# Altium schematic sheet ESP-WROOM32.SchDoc (part 3 of 3)
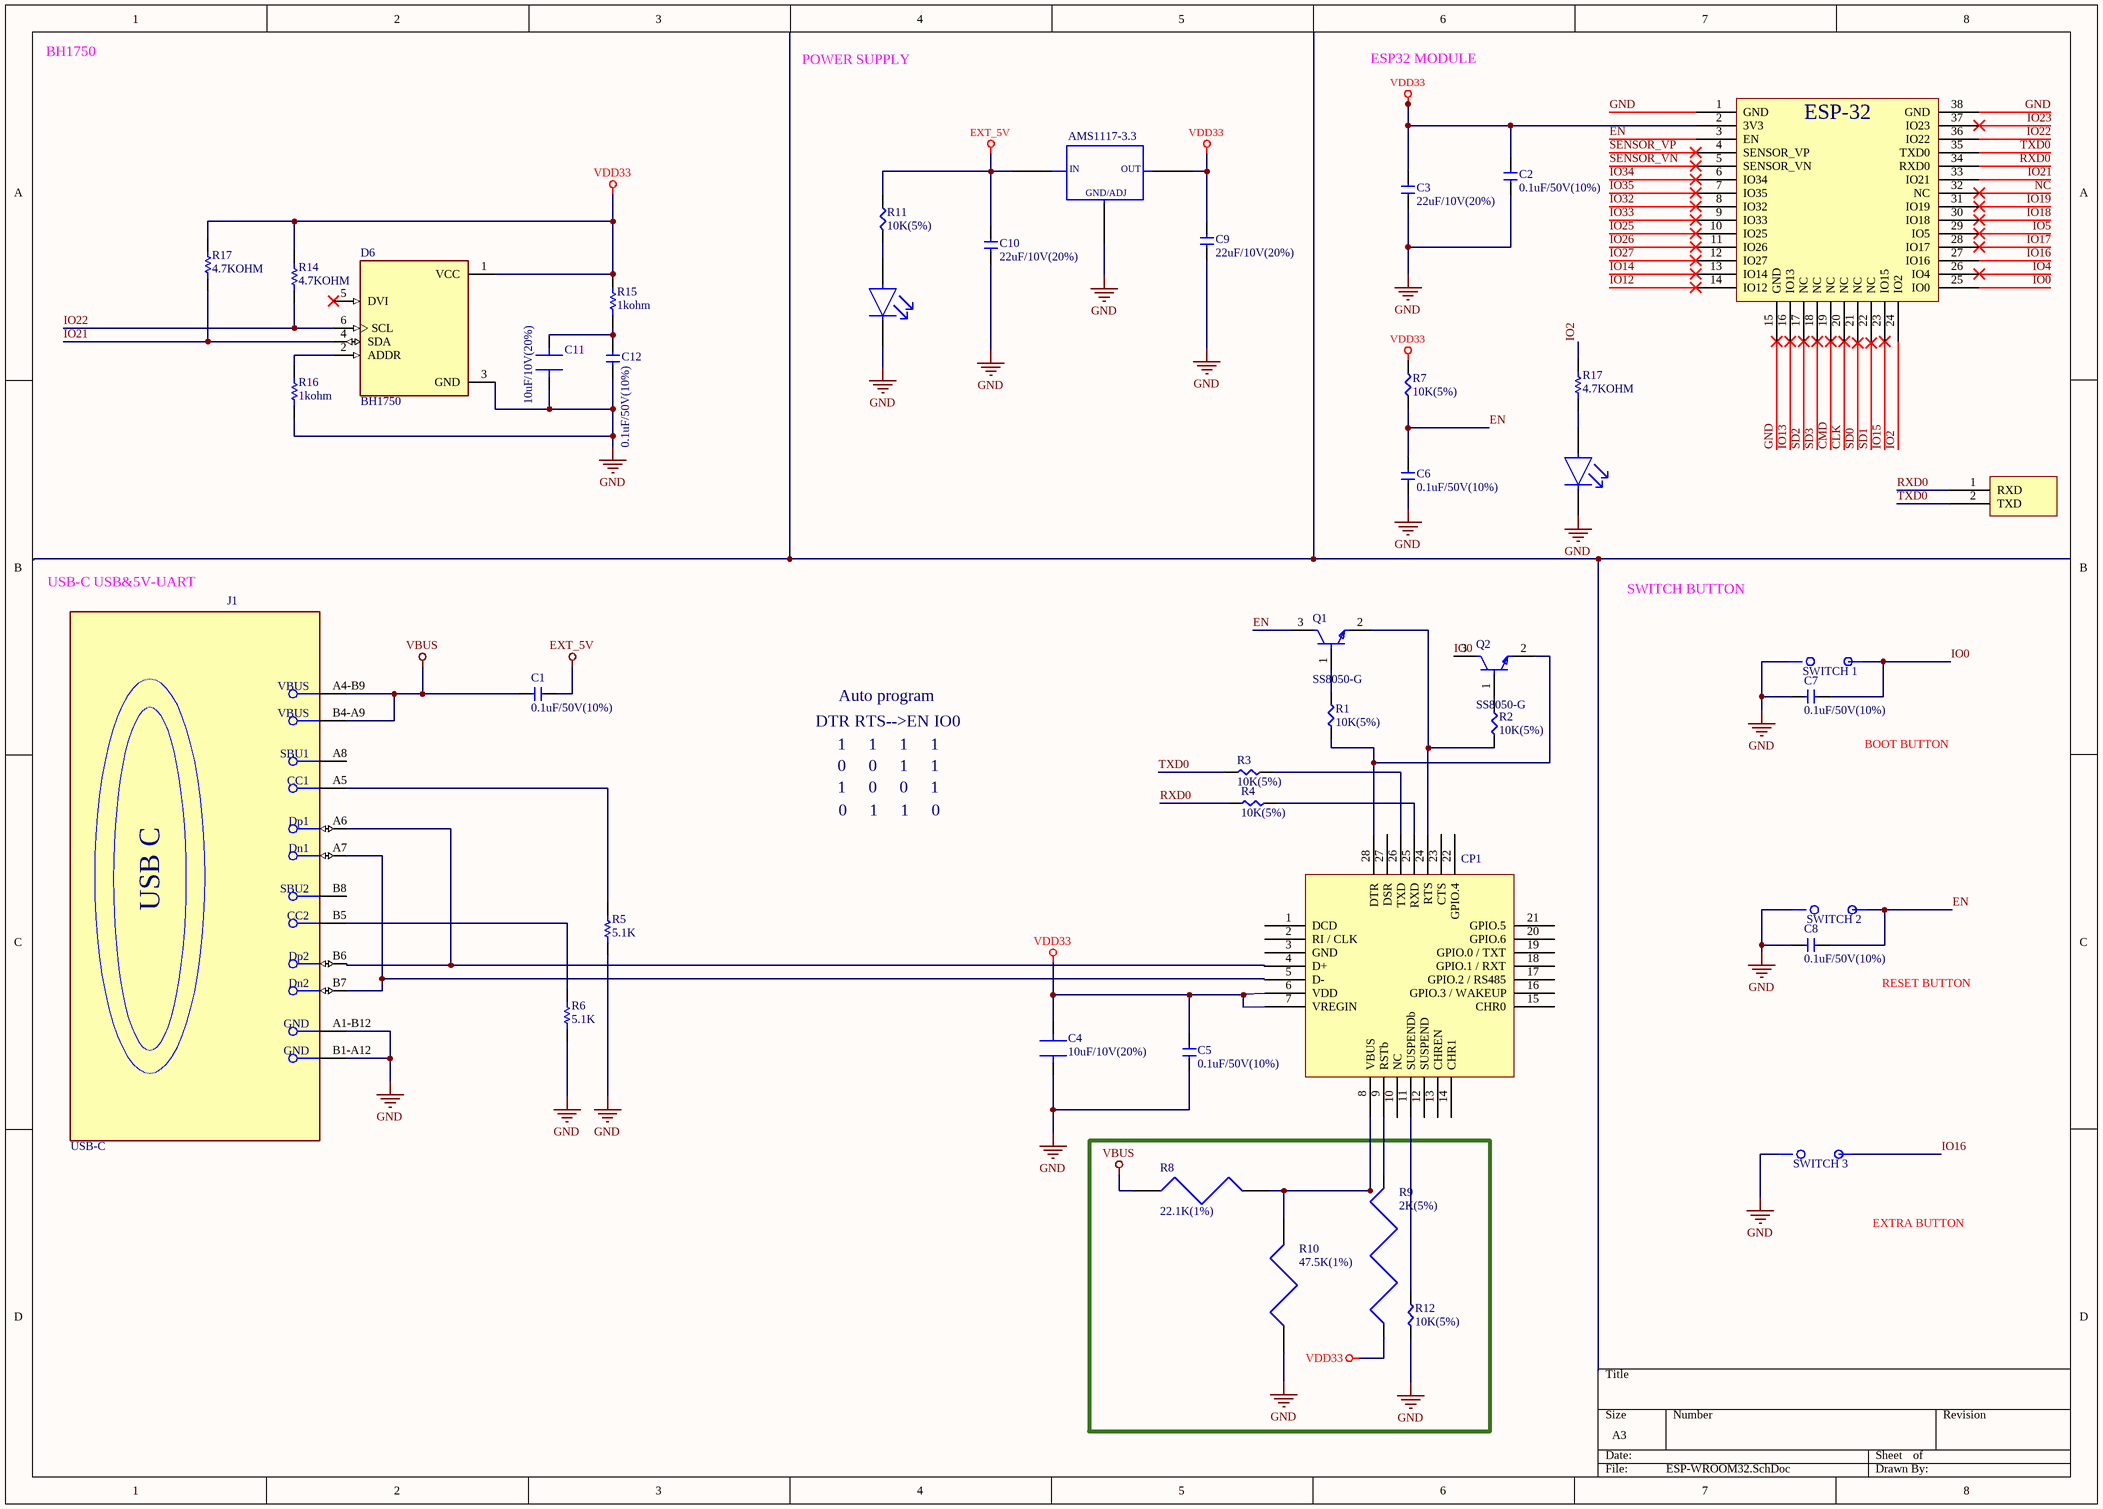
[diagram p2: ESP-WROOM32.SchDoc]

## Library data of the parts (continued)
R9 = RC1206JR-132KL: RES 2K OHM 5% 1/4W 1206; Manufacturer: Yageo Group; Manufacturer Part Number: RC0402JR-072KL; Power Dissipation: 62.5mW; Value: 2kΩ; Temperature Coefficient: 100ppm/°C; Voltage Rating: 50V; Supplier: DigiKey; Supplier Part Number: 311-2.0KJRCT-ND; RoHS: Compliant; Category: Chip SMD Resistors; Stock: 102655; Pricing: 1=0.1, 10=0.006, 25=0.0056, 50=0.0052, 100=0.0046, 250=0.00416, 500=0.00284 (USD); Case/Package: 0402; Case Code (Imperial): 0402; China RoHS: Non-Compliant; Composition: Thick Film; Contact Plating: Tin; Depth: 500µm; Height: 350µm; Lead Free: Lead Free; Length: 1mm; Lifecycle Status: Production; Max Operating Temperature: 155°C; Military Standard: Not; Min Operating Temperature: -55°C; Mounting Technology: Surface Mount; Pins: 2; Number of Terminals: 2; Packaging: Tape & Reel; Power Rating: 62.5mW; Radiation Hardening: No; REACH SVHC: Yes; Schedule B: 8533210045, 8533210045|8533210045|8533210045|8533210045|8533210045; Termination: SMD/SMT; Tolerance: 5%; Voltage Rating (DC): 50V; Width: 500µm; Working Voltage: 50V; ComponentLink1URL: https://datasheet.octopart.com:443/RC0402JR-072KL-Yageo-datasheet-175887523.pdf?src-supplier=Newark; ComponentLink1Description: https://datasheet.octopart.com:443/RC0402JR-072KL-Yageo-datasheet-175887523.pdf?src-supplier=Newark; ComponentLink2URL: https://datasheet.octopart.com:443/RC0402JR-072KL-Yageo-datasheet-10408619.pdf?src-supplier=Farnell; ComponentLink2Description: https://datasheet.octopart.com:443/RC0402JR-072KL-Yageo-datasheet-10408619.pdf?src-supplier=Farnell; ComponentLink3URL: https://datasheet.octopart.com:443/RC0402JR-072KL-Yageo-datasheet-62067350.pdf?src-supplier=Farnell; ComponentLink3Description: https://datasheet.octopart.com:443/RC0402JR-072KL-Yageo-datasheet-62067350.pdf?src-supplier=Farnell; ComponentLink4URL: https://datasheet.octopart.com:443/RC0402JR-072KL-Yageo-datasheet-164759695.pdf?src-supplier=Future+Electronics; ComponentLink4Description: https://datasheet.octopart.com:443/RC0402JR-072KL-Yageo-datasheet-164759695.pdf?src-supplier=Future+Electronics; ComponentLink5URL: https://datasheet.octopart.com:443/RC0402JR-072KL-Yageo-datasheet-137700087.pdf?src-supplier=Future+Electronics; ComponentLink5Description: https://datasheet.octopart.com:443/RC0402JR-072KL-Yageo-datasheet-137700087.pdf?src-supplier=Future+Electronics; ComponentLink6URL: https://datasheet.octopart.com:443/RC0402JR-072KL-Yageo-datasheet-12531192.pdf?src-supplier=Future+Electronics; ComponentLink6Description: https://datasheet.octopart.com:443/RC0402JR-072KL-Yageo-datasheet-12531192.pdf?src-supplier=Future+Electronics; ComponentLink7URL: https://datasheet.octopart.com:443/RC0402JR-072KL-Yageo-datasheet-505231.pdf?src-supplier=Future+Electronics; ComponentLink7Description: https://datasheet.octopart.com:443/RC0402JR-072KL-Yageo-datasheet-505231.pdf?src-supplier=Future+Electronics; ComponentLink8URL: https://datasheet.octopart.com/RC0402JR-072KL-Yageo-datasheet-73766026.pdf; ComponentLink8Description: https://datasheet.octopart.com/RC0402JR-072KL-Yageo-datasheet-73766026.pdf; ComponentLink9URL: https://datasheet.octopart.com:443/RC0402JR-072KL-Yageo-datasheet-8329306.pdf?src-supplier=element14; ComponentLink9Description: https://datasheet.octopart.com:443/RC0402JR-072KL-Yageo-datasheet-8329306.pdf?src-supplier=element14; ComponentLink10URL: https://datasheet.octopart.com:443/RC0402JR-072KL-Yageo-datasheet-8324527.pdf?src-supplier=TME; ComponentLink10Description: https://datasheet.octopart.com:443/RC0402JR-072KL-Yageo-datasheet-8324527.pdf?src-supplier=TME; ComponentLink11URL: http://sigma.octopart.com:80/rohs_statement/Yageo-company-2.pdf?src-supplier=Compliance+Statements; ComponentLink11Description: http://sigma.octopart.com:80/rohs_statement/Yageo-company-2.pdf?src-supplier=Compliance+Statements; ComponentLink12URL: http://sigma.octopart.com:80/conflict_mineral_statement/Yageo-company-3.pdf?src-supplier=Compliance+Statements; ComponentLink12Description: http://sigma.octopart.com:80/conflict_mineral_statement/Yageo-company-3.pdf?src-supplier=Compliance+Statements; LCSC PART NUMBER: C108081; Case Code (Metric): 3216; ComponentLink13URL: https://datasheet.octopart.com:443/RC1206JR-132KL-Yageo-datasheet-175887523.pdf?src-supplier=IHS; ComponentLink13Description: https://datasheet.octopart.com:443/RC1206JR-132KL-Yageo-datasheet-175887523.pdf?src-supplier=IHS; ComponentLink14URL: https://datasheet.octopart.com:443/RC1206JR-132KL-Yageo-datasheet-164759695.pdf?src-supplier=Future+Electronics; ComponentLink14Description: https://datasheet.octopart.com:443/RC1206JR-132KL-Yageo-datasheet-164759695.pdf?src-supplier=Future+Electronics; ComponentLink15URL: https://datasheet.octopart.com:443/RC1206JR-132KL-Yageo-datasheet-137700087.pdf?src-supplier=Future+Electronics; ComponentLink15Description: https://datasheet.octopart.com:443/RC1206JR-132KL-Yageo-datasheet-137700087.pdf?src-supplier=Future+Electronics; ComponentLink16URL: https://datasheet.octopart.com:443/RC1206JR-132KL-Yageo-datasheet-27233761.pdf?src-supplier=Future+Electronics; ComponentLink16Description: https://datasheet.octopart.com:443/RC1206JR-132KL-Yageo-datasheet-27233761.pdf?src-supplier=Future+Electronics; ComponentLink17URL: https://datasheet.octopart.com:443/RC1206JR-132KL-Yageo-datasheet-13032847.pdf?src-supplier=Future+Electronics; ComponentLink17Description: https://datasheet.octopart.com:443/RC1206JR-132KL-Yageo-datasheet-13032847.pdf?src-supplier=Future+Electronics; ComponentLink18URL: https://datasheet.octopart.com:443/RC1206JR-132KL-Yageo-datasheet-8359522.pdf?src-supplier=Future+Electronics; ComponentLink18Description: https://datasheet.octopart.com:443/RC1206JR-132KL-Yageo-datasheet-8359522.pdf?src-supplier=Future+Electronics; ComponentLink19URL: https://datasheet.octopart.com/RC1206JR-132KL-Yageo-datasheet-73766026.pdf; ComponentLink19Description: https://datasheet.octopart.com/RC1206JR-132KL-Yageo-datasheet-73766026.pdf; Parameter 1: *
R10 = RC1206FR-0747K5L: RES 47.5K OHM 1% 1/4W 1206; Manufacturer: Yageo Group; Manufacturer Part Number: RC0402FR-1347K5L; Power Dissipation: 62.5mW; Value: 47.5kΩ; Temperature Coefficient: 100ppm/°C; Working Voltage: 50V; Max Power Dissipation: 250mW; Voltage Rating: 200V; Supplier: DigiKey; Supplier Part Number: 13-RC0402FR-1347K5LCT-ND; RoHS: Compliant; Category: Chip SMD Resistors; Stock: 75939; Pricing: 1=0.1, 10=0.02, 25=0.014, 50=0.0112, 100=0.009, 250=0.00688, 500=0.00566, 1000=0.00474, 5000=0.00328 (USD); Case/Package: 0402; China RoHS: Non-Compliant; Composition: Thick Film; Contact Plating: Tin; Depth: 500µm; Height: 350µm; Length: 1mm; Lifecycle Status: Production; Max Operating Temperature: 155°C; Military Standard: Not; Min Operating Temperature: -55°C; Mounting Technology: Surface Mount; Number of Terminals: 2; REACH SVHC: Yes; Tolerance: 1%; Width: 500µm; ComponentLink1URL: https://datasheet.octopart.com:443/RC0402FR-1347K5L-Yageo-datasheet-175887523.pdf?src-supplier=IHS; ComponentLink1Description: https://datasheet.octopart.com:443/RC0402FR-1347K5L-Yageo-datasheet-175887523.pdf?src-supplier=IHS; ComponentLink2URL: https://datasheet.octopart.com:443/RC0402FR-1347K5L-Yageo-Group-datasheet-189192902.pdf?src-supplier=TME; ComponentLink2Description: https://datasheet.octopart.com:443/RC0402FR-1347K5L-Yageo-Group-datasheet-189192902.pdf?src-supplier=TME; ComponentLink3URL: https://datasheet.octopart.com:443/RC0402FR-1347K5L-Yageo-Group-datasheet-176638170.pdf?src-supplier=TME; ComponentLink3Description: https://datasheet.octopart.com:443/RC0402FR-1347K5L-Yageo-Group-datasheet-176638170.pdf?src-supplier=TME; ComponentLink4URL: https://datasheet.octopart.com/RC0402FR-1347K5L-Yageo-datasheet-73766026.pdf; ComponentLink4Description: https://datasheet.octopart.com/RC0402FR-1347K5L-Yageo-datasheet-73766026.pdf; ComponentLink5URL: https://datasheet.octopart.com:443/RC0402FR-1347K5L-Yageo-datasheet-10408619.pdf?src-supplier=_legacy+Avnet; ComponentLink5Description: https://datasheet.octopart.com:443/RC0402FR-1347K5L-Yageo-datasheet-10408619.pdf?src-supplier=_legacy+Avnet; ComponentLink6URL: http://sigma.octopart.com:80/conflict_mineral_statement/Yageo-company-3.pdf?src-supplier=Compliance+Statements; ComponentLink6Description: http://sigma.octopart.com:80/conflict_mineral_statement/Yageo-company-3.pdf?src-supplier=Compliance+Statements; ComponentLink7URL: http://sigma.octopart.com:80/rohs_statement/Yageo-company-2.pdf?src-supplier=Compliance+Statements; ComponentLink7Description: http://sigma.octopart.com:80/rohs_statement/Yageo-company-2.pdf?src-supplier=Compliance+Statements; LCSC PART NUMBER: C137271; Case Code (Imperial): 1206; Case Code (Metric): 3216; Features: Moisture Resistant; Lead Free: Lead Free; Number of Terminations: 2; Packaging: Tape & Reel; Power Rating: 250mW; Schedule B: 8533210045, 8533210045|8533210045|8533210045|8533210045|8533210045|8533210045|8533210045|8533210045|8533210045|8533210045|8533210045|8533210045|8533210045|8533210045|8533210045|8533210045, 8533210045|8533210045|8533210045|8533210045|8533210045|8533210045|8533210045|8533210045|8533210045|8533210045|8533210045|8533210045|8533210045|8533210045|8533210045|8533210045|8533210045, 8533210045|8533210045|8533210045|8533210045|8533210045|8533210045|8533210045|8533210045|8533210045|8533210045|8533210045|8533210045|8533210045|8533210045|8533210045|8533210045|8533210045|8533210045; Termination: SMD/SMT; Voltage Rating (DC): 200V; ComponentLink8URL: https://datasheet.octopart.com:443/RC1206FR-0747K5L-Yageo-datasheet-175887523.pdf?src-supplier=Newark; ComponentLink8Description: https://datasheet.octopart.com:443/RC1206FR-0747K5L-Yageo-datasheet-175887523.pdf?src-supplier=Newark; ComponentLink9URL: https://datasheet.octopart.com:443/RC1206FR-0747K5L-Yageo-datasheet-103092701.pdf?src-supplier=Upverter; ComponentLink9Description: https://datasheet.octopart.com:443/RC1206FR-0747K5L-Yageo-datasheet-103092701.pdf?src-supplier=Upverter; ComponentLink10URL: https://datasheet.octopart.com:443/RC1206FR-0747K5L-Yageo-Group-datasheet-189192902.pdf?src-supplier=TME; ComponentLink10Description: https://datasheet.octopart.com:443/RC1206FR-0747K5L-Yageo-Group-datasheet-189192902.pdf?src-supplier=TME; ComponentLink11URL: https://datasheet.octopart.com:443/RC1206FR-0747K5L-Yageo-Group-datasheet-176638170.pdf?src-supplier=TME; ComponentLink11Description: https://datasheet.octopart.com:443/RC1206FR-0747K5L-Yageo-Group-datasheet-176638170.pdf?src-supplier=TME; ComponentLink12URL: https://datasheet.octopart.com:443/RC1206FR-0747K5L-Yageo-datasheet-164759695.pdf?src-supplier=Future+Electronics; ComponentLink12Description: https://datasheet.octopart.com:443/RC1206FR-0747K5L-Yageo-datasheet-164759695.pdf?src-supplier=Future+Electronics; ComponentLink13URL: https://datasheet.octopart.com:443/RC1206FR-0747K5L-Yageo-datasheet-137700087.pdf?src-supplier=Future+Electronics; ComponentLink13Description: https://datasheet.octopart.com:443/RC1206FR-0747K5L-Yageo-datasheet-137700087.pdf?src-supplier=Future+Electronics; ComponentLink14URL: https://datasheet.octopart.com:443/RC1206FR-0747K5L-Yageo-datasheet-27233761.pdf?src-supplier=Future+Electronics; ComponentLink14Description: https://datasheet.octopart.com:443/RC1206FR-0747K5L-Yageo-datasheet-27233761.pdf?src-supplier=Future+Electronics; ComponentLink15URL: https://datasheet.octopart.com:443/RC1206FR-0747K5L-Yageo-datasheet-13032847.pdf?src-supplier=Future+Electronics; ComponentLink15Description: https://datasheet.octopart.com:443/RC1206FR-0747K5L-Yageo-datasheet-13032847.pdf?src-supplier=Future+Electronics; ComponentLink16URL: https://datasheet.octopart.com:443/RC1206FR-0747K5L-Yageo-datasheet-8359522.pdf?src-supplier=Future+Electronics; ComponentLink16Description: https://datasheet.octopart.com:443/RC1206FR-0747K5L-Yageo-datasheet-8359522.pdf?src-supplier=Future+Electronics; ComponentLink17URL: https://datasheet.octopart.com/RC1206FR-0747K5L-Yageo-datasheet-73766026.pdf; ComponentLink17Description: https://datasheet.octopart.com/RC1206FR-0747K5L-Yageo-datasheet-73766026.pdf; ComponentLink18URL: https://datasheet.octopart.com:443/RC1206FR-0747K5L-Yageo-datasheet-118639.pdf?src-supplier=DigiKey; ComponentLink18Description: https://datasheet.octopart.com:443/RC1206FR-0747K5L-Yageo-datasheet-118639.pdf?src-supplier=DigiKey
R14 R17#1 R17#2 = RC1206JR-074K7L: RES 4.7K OHM 5% 1/4W 1206; Manufacturer: Yageo Group; Manufacturer Part Number: RC0402JR-0747KL; Max Power Dissipation: 63mW; Power Dissipation: 62.5mW; Value: 47kΩ; Temperature Coefficient: 100ppm/°C; Voltage Rating: 50V; Supplier: DigiKey; Supplier Part Number: 311-47KJRCT-ND; RoHS: Compliant; Category: Chip SMD Resistors; Stock: 272791; Pricing: 1=0.1, 10=0.006, 25=0.0044, 50=0.003, 100=0.0028 (USD); Case/Package: 0402; Case Code (Imperial): 0402; China RoHS: Non-Compliant; Composition: Thick Film; Depth: 500µm; Features: Moisture Resistant; Height: 350µm; Lead Free: Lead Free; Length: 1mm; Lifecycle Status: Production; Max Operating Temperature: 155°C; Military Standard: Not; Min Operating Temperature: -55°C; Mounting Technology: Surface Mount; Pins: 2; Number of Terminals: 2; Number of Terminations: 2; Packaging: Tape & Reel; Power Rating: 63mW; REACH SVHC: Yes; Schedule B: 8533210045, 8533210045|8533210045, 8533210045|8533210045|8533210045, 8533210045|8533210045|8533210045|8533210045; Termination: SMD/SMT; Tolerance: 5%; Voltage Rating (AC): 50V; Voltage Rating (DC): 50V; Width: 500µm; Working Voltage: 50V; ComponentLink1URL: https://datasheet.octopart.com:443/RC0402JR-0747KL-Yageo-datasheet-175887523.pdf?src-supplier=IHS; ComponentLink1Description: https://datasheet.octopart.com:443/RC0402JR-0747KL-Yageo-datasheet-175887523.pdf?src-supplier=IHS; ComponentLink2URL: https://datasheet.octopart.com:443/RC0402JR-0747KL-Yageo-datasheet-10408619.pdf?src-supplier=Newark; ComponentLink2Description: https://datasheet.octopart.com:443/RC0402JR-0747KL-Yageo-datasheet-10408619.pdf?src-supplier=Newark; ComponentLink3URL: https://datasheet.octopart.com:443/RC0402JR-0747KL-Yageo-datasheet-8324527.pdf?src-supplier=Newark; ComponentLink3Description: https://datasheet.octopart.com:443/RC0402JR-0747KL-Yageo-datasheet-8324527.pdf?src-supplier=Newark; ComponentLink4URL: https://datasheet.octopart.com:443/RC0402JR-0747KL-Yageo-datasheet-98239111.pdf?src-supplier=Upverter; ComponentLink4Description: https://datasheet.octopart.com:443/RC0402JR-0747KL-Yageo-datasheet-98239111.pdf?src-supplier=Upverter; ComponentLink5URL: https://datasheet.octopart.com:443/RC0402JR-0747KL-Yageo-datasheet-62067350.pdf?src-supplier=element14+APAC; ComponentLink5Description: https://datasheet.octopart.com:443/RC0402JR-0747KL-Yageo-datasheet-62067350.pdf?src-supplier=element14+APAC; ComponentLink6URL: https://datasheet.octopart.com:443/RC0402JR-0747KL-Yageo-datasheet-176638170.pdf?src-supplier=JRH+Electronics; ComponentLink6Description: https://datasheet.octopart.com:443/RC0402JR-0747KL-Yageo-datasheet-176638170.pdf?src-supplier=JRH+Electronics; ComponentLink7URL: https://datasheet.octopart.com:443/RC0402JR-0747KL-Yageo-datasheet-164759695.pdf?src-supplier=Future+Electronics; ComponentLink7Description: https://datasheet.octopart.com:443/RC0402JR-0747KL-Yageo-datasheet-164759695.pdf?src-supplier=Future+Electronics; ComponentLink8URL: https://datasheet.octopart.com:443/RC0402JR-0747KL-Yageo-datasheet-137700087.pdf?src-supplier=Future+Electronics; ComponentLink8Description: https://datasheet.octopart.com:443/RC0402JR-0747KL-Yageo-datasheet-137700087.pdf?src-supplier=Future+Electronics; ComponentLink9URL: https://datasheet.octopart.com:443/RC0402JR-0747KL-Yageo-datasheet-12531192.pdf?src-supplier=Future+Electronics; ComponentLink9Description: https://datasheet.octopart.com:443/RC0402JR-0747KL-Yageo-datasheet-12531192.pdf?src-supplier=Future+Electronics; ComponentLink10URL: https://datasheet.octopart.com:443/RC0402JR-0747KL-Yageo-datasheet-8324255.pdf?src-supplier=Future+Electronics; ComponentLink10Description: https://datasheet.octopart.com:443/RC0402JR-0747KL-Yageo-datasheet-8324255.pdf?src-supplier=Future+Electronics; ComponentLink11URL: https://datasheet.octopart.com:443/RC0402JR-0747KL-Yageo-datasheet-148775077.pdf?src-supplier=TME; ComponentLink11Description: https://datasheet.octopart.com:443/RC0402JR-0747KL-Yageo-datasheet-148775077.pdf?src-supplier=TME; ComponentLink12URL: https://datasheet.octopart.com/RC0402JR-0747KL-Yageo-datasheet-73766026.pdf; ComponentLink12Description: https://datasheet.octopart.com/RC0402JR-0747KL-Yageo-datasheet-73766026.pdf; ComponentLink13URL: https://datasheet.octopart.com:443/RC0402JR-0747KL-Yageo-datasheet-8329306.pdf?src-supplier=element14; ComponentLink13Description: https://datasheet.octopart.com:443/RC0402JR-0747KL-Yageo-datasheet-8329306.pdf?src-supplier=element14; ComponentLink14URL: http://sigma.octopart.com:80/rohs_statement/Yageo-company-2.pdf?src-supplier=Compliance+Statements; ComponentLink14Description: http://sigma.octopart.com:80/rohs_statement/Yageo-company-2.pdf?src-supplier=Compliance+Statements; ComponentLink15URL: http://sigma.octopart.com:80/conflict_mineral_statement/Yageo-company-3.pdf?src-supplier=Compliance+Statements; ComponentLink15Description: http://sigma.octopart.com:80/conflict_mineral_statement/Yageo-company-3.pdf?src-supplier=Compliance+Statements; LCSC PART NUMBER: C136458; Case Code (Metric): 3216; ComponentLink16URL: https://datasheet.octopart.com:443/RC1206JR-074K7L-Yageo-datasheet-175887523.pdf?src-supplier=Newark; ComponentLink16Description: https://datasheet.octopart.com:443/RC1206JR-074K7L-Yageo-datasheet-175887523.pdf?src-supplier=Newark; ComponentLink17URL: https://datasheet.octopart.com:443/RC1206JR-074K7L-Yageo-datasheet-12512621.pdf?src-supplier=Newark; ComponentLink17Description: https://datasheet.octopart.com:443/RC1206JR-074K7L-Yageo-datasheet-12512621.pdf?src-supplier=Newark; ComponentLink18URL: https://datasheet.octopart.com:443/RC1206JR-074K7L-Yageo-datasheet-141435363.pdf?src-supplier=Upverter; ComponentLink18Description: https://datasheet.octopart.com:443/RC1206JR-074K7L-Yageo-datasheet-141435363.pdf?src-supplier=Upverter; ComponentLink19URL: https://datasheet.octopart.com:443/RC1206JR-074K7L-Yageo-datasheet-8359522.pdf?src-supplier=element14+APAC; ComponentLink19Description: https://datasheet.octopart.com:443/RC1206JR-074K7L-Yageo-datasheet-8359522.pdf?src-supplier=element14+APAC; ComponentLink20URL: https://datasheet.octopart.com:443/RC1206JR-074K7L-Yageo-datasheet-62067350.pdf?src-supplier=Farnell; ComponentLink20Description: https://datasheet.octopart.com:443/RC1206JR-074K7L-Yageo-datasheet-62067350.pdf?src-supplier=Farnell; ComponentLink21URL: https://datasheet.octopart.com:443/RC1206JR-074K7L-Yageo-datasheet-164759695.pdf?src-supplier=Future+Electronics; ComponentLink21Description: https://datasheet.octopart.com:443/RC1206JR-074K7L-Yageo-datasheet-164759695.pdf?src-supplier=Future+Electronics; ComponentLink22URL: https://datasheet.octopart.com:443/RC1206JR-074K7L-Yageo-datasheet-127823281.pdf?src-supplier=Future+Electronics; ComponentLink22Description: https://datasheet.octopart.com:443/RC1206JR-074K7L-Yageo-datasheet-127823281.pdf?src-supplier=Future+Electronics; ComponentLink23URL: https://datasheet.octopart.com:443/RC1206JR-074K7L-Yageo-datasheet-137700087.pdf?src-supplier=Future+Electronics; ComponentLink23Description: https://datasheet.octopart.com:443/RC1206JR-074K7L-Yageo-datasheet-137700087.pdf?src-supplier=Future+Electronics; ComponentLink24URL: https://datasheet.octopart.com:443/RC1206JR-074K7L-Yageo-datasheet-103092701.pdf?src-supplier=Future+Electronics; ComponentLink24Description: https://datasheet.octopart.com:443/RC1206JR-074K7L-Yageo-datasheet-103092701.pdf?src-supplier=Future+Electronics; ComponentLink25URL: https://datasheet.octopart.com:443/RC1206JR-074K7L-Yageo-datasheet-27233761.pdf?src-supplier=Future+Electronics; ComponentLink25Description: https://datasheet.octopart.com:443/RC1206JR-074K7L-Yageo-datasheet-27233761.pdf?src-supplier=Future+Electronics; ComponentLink26URL: https://datasheet.octopart.com:443/RC1206JR-074K7L-Yageo-datasheet-13032847.pdf?src-supplier=Future+Electronics; ComponentLink26Description: https://datasheet.octopart.com:443/RC1206JR-074K7L-Yageo-datasheet-13032847.pdf?src-supplier=Future+Electronics; ComponentLink27URL: https://datasheet.octopart.com:443/RC1206JR-074K7L-Yageo-datasheet-8324387.pdf?src-supplier=Future+Electronics; ComponentLink27Description: https://datasheet.octopart.com:443/RC1206JR-074K7L-Yageo-datasheet-8324387.pdf?src-supplier=Future+Electronics; ComponentLink28URL: https://datasheet.octopart.com/RC1206JR-074K7L-Yageo-datasheet-73766026.pdf; ComponentLink28Description: https://datasheet.octopart.com/RC1206JR-074K7L-Yageo-datasheet-73766026.pdf; ComponentLink29URL: https://datasheet.octopart.com:443/RC1206JR-074K7L-Yageo-datasheet-118639.pdf?src-supplier=DigiKey; ComponentLink29Description: https://datasheet.octopart.com:443/RC1206JR-074K7L-Yageo-datasheet-118639.pdf?src-supplier=DigiKey; ComponentLink30URL: https://datasheet.octopart.com:443/RC1206JR-074K7L-Yageo-datasheet-499455.pdf?src-supplier=element14; ComponentLink30Description: https://datasheet.octopart.com:443/RC1206JR-074K7L-Yageo-datasheet-499455.pdf?src-supplier=element14; ComponentLink31URL: https://datasheet.octopart.com:443/RC1206JR-074K7L-Yageo-datasheet-6387275.pdf?src-supplier=element14; ComponentLink31Description: https://datasheet.octopart.com:443/RC1206JR-074K7L-Yageo-datasheet-6387275.pdf?src-supplier=element14
R15 R16 = RC1206JR-071KL: RES 1K OHM 5% 1/4W 1206; Manufacturer: Yageo Group; Manufacturer Part Number: RC0402JR-071KL; LSCS PART NUMBER: C112223; Max Power Dissipation: 63mW; Power Dissipation: 62.5mW; Value: 1kΩ; Temperature Coefficient: 100ppm/°C; Voltage Rating: 50V; Supplier: DigiKey; Supplier Part Number: 311-1.0KJRCT-ND; RoHS: Compliant; Category: Chip SMD Resistors; Stock: 6491283; Pricing: 1=0.1, 10=0.006, 25=0.0052, 50=0.004, 100=0.0036, 250=0.00284 (USD); Case/Package: 0402; Case Code (Imperial): 0402; China RoHS: Non-Compliant; Composition: Thick Film; Depth: 500µm; Features: Moisture Resistant; Height: 350µm; Lead Free: Lead Free; Length: 1mm; Lifecycle Status: Production; Max Operating Temperature: 155°C; Military Standard: Not; Min Operating Temperature: -55°C; Mounting Technology: Surface Mount; Pins: 2; Number of Terminals: 2; Number of Terminations: 2; Packaging: Tape & Reel; Power Rating: 62.5mW; REACH SVHC: Yes; Schedule B: 8533210045, 8533210045|8533210045, 8533210045|8533210045|8533210045, 8533210045|8533210045|8533210045|8533210045; Termination: SMD/SMT; Tolerance: 5%; Voltage Rating (AC): 50V; Voltage Rating (DC): 50V; Width: 500µm; Working Voltage: 50V; ComponentLink1URL: https://datasheet.octopart.com:443/RC0402JR-071KL-Yageo-datasheet-175887523.pdf?src-supplier=Farnell; ComponentLink1Description: https://datasheet.octopart.com:443/RC0402JR-071KL-Yageo-datasheet-175887523.pdf?src-supplier=Farnell; ComponentLink2URL: https://datasheet.octopart.com:443/RC0402JR-071KL-Yageo-datasheet-8324527.pdf?src-supplier=Farnell; ComponentLink2Description: https://datasheet.octopart.com:443/RC0402JR-071KL-Yageo-datasheet-8324527.pdf?src-supplier=Farnell; ComponentLink3URL: https://datasheet.octopart.com:443/RC0402JR-071KL-Yageo-datasheet-10408619.pdf?src-supplier=Newark; ComponentLink3Description: https://datasheet.octopart.com:443/RC0402JR-071KL-Yageo-datasheet-10408619.pdf?src-supplier=Newark; ComponentLink4URL: https://datasheet.octopart.com:443/RC0402JR-071KL-Yageo-datasheet-505231.pdf?src-supplier=Newark; ComponentLink4Description: https://datasheet.octopart.com:443/RC0402JR-071KL-Yageo-datasheet-505231.pdf?src-supplier=Newark; ComponentLink5URL: https://datasheet.octopart.com:443/RC0402JR-071KL-Yageo-datasheet-79472498.pdf?src-supplier=Upverter; ComponentLink5Description: https://datasheet.octopart.com:443/RC0402JR-071KL-Yageo-datasheet-79472498.pdf?src-supplier=Upverter; ComponentLink6URL: https://datasheet.octopart.com:443/RC0402JR-071KL-Yageo-datasheet-44585784.pdf?src-supplier=Upverter; ComponentLink6Description: https://datasheet.octopart.com:443/RC0402JR-071KL-Yageo-datasheet-44585784.pdf?src-supplier=Upverter; ComponentLink7URL: https://datasheet.octopart.com:443/RC0402JR-071KL-Yageo-datasheet-62067350.pdf?src-supplier=element14+APAC; ComponentLink7Description: https://datasheet.octopart.com:443/RC0402JR-071KL-Yageo-datasheet-62067350.pdf?src-supplier=element14+APAC; ComponentLink8URL: https://datasheet.octopart.com:443/RC0402JR-071KL-Yageo-datasheet-148775077.pdf?src-supplier=JRH+Electronics; ComponentLink8Description: https://datasheet.octopart.com:443/RC0402JR-071KL-Yageo-datasheet-148775077.pdf?src-supplier=JRH+Electronics; ComponentLink9URL: https://datasheet.octopart.com:443/RC0402JR-071KL-Yageo-datasheet-12531192.pdf?src-supplier=Seeed+Studio; ComponentLink9Description: https://datasheet.octopart.com:443/RC0402JR-071KL-Yageo-datasheet-12531192.pdf?src-supplier=Seeed+Studio; ComponentLink10URL: https://datasheet.octopart.com:443/RC0402JR-071KL-Yageo-datasheet-164759695.pdf?src-supplier=Future+Electronics; ComponentLink10Description: https://datasheet.octopart.com:443/RC0402JR-071KL-Yageo-datasheet-164759695.pdf?src-supplier=Future+Electronics; ComponentLink11URL: https://datasheet.octopart.com:443/RC0402JR-071KL-Yageo-datasheet-137700087.pdf?src-supplier=Future+Electronics; ComponentLink11Description: https://datasheet.octopart.com:443/RC0402JR-071KL-Yageo-datasheet-137700087.pdf?src-supplier=Future+Electronics; ComponentLink12URL: https://datasheet.octopart.com/RC0402JR-071KL-Yageo-datasheet-73766026.pdf; ComponentLink12Description: https://datasheet.octopart.com/RC0402JR-071KL-Yageo-datasheet-73766026.pdf; ComponentLink13URL: https://datasheet.octopart.com:443/RC0402JR-071KL-Yageo-datasheet-8329306.pdf?src-supplier=element14; ComponentLink13Description: https://datasheet.octopart.com:443/RC0402JR-071KL-Yageo-datasheet-8329306.pdf?src-supplier=element14; ComponentLink14URL: http://sigma.octopart.com:80/rohs_statement/Yageo-company-2.pdf?src-supplier=Compliance+Statements; ComponentLink14Description: http://sigma.octopart.com:80/rohs_statement/Yageo-company-2.pdf?src-supplier=Compliance+Statements; ComponentLink15URL: http://sigma.octopart.com:80/conflict_mineral_statement/Yageo-company-3.pdf?src-supplier=Compliance+Statements; ComponentLink15Description: http://sigma.octopart.com:80/conflict_mineral_statement/Yageo-company-3.pdf?src-supplier=Compliance+Statements; LCSC PART NUMBER: C105637; Case Code (Metric): 3216; ComponentLink16URL: https://datasheet.octopart.com:443/RC1206JR-071KL-Yageo-datasheet-175887523.pdf?src-supplier=Newark; ComponentLink16Description: https://datasheet.octopart.com:443/RC1206JR-071KL-Yageo-datasheet-175887523.pdf?src-supplier=Newark; ComponentLink17URL: https://datasheet.octopart.com:443/RC1206JR-071KL-Yageo-datasheet-13032847.pdf?src-supplier=element14+APAC; ComponentLink17Description: https://datasheet.octopart.com:443/RC1206JR-071KL-Yageo-datasheet-13032847.pdf?src-supplier=element14+APAC; ComponentLink18URL: https://datasheet.octopart.com:443/RC1206JR-071KL-Yageo-datasheet-62067350.pdf?src-supplier=element14+APAC; ComponentLink18Description: https://datasheet.octopart.com:443/RC1206JR-071KL-Yageo-datasheet-62067350.pdf?src-supplier=element14+APAC; ComponentLink19URL: https://datasheet.octopart.com:443/RC1206JR-071KL-Yageo-datasheet-141265859.pdf?src-supplier=Upverter; ComponentLink19Description: https://datasheet.octopart.com:443/RC1206JR-071KL-Yageo-datasheet-141265859.pdf?src-supplier=Upverter; ComponentLink20URL: https://sigma.octopart.com:443/138820526/technical_drawing/Yageo-RC1206JR-071KL.pdf?src-supplier=Upverter; ComponentLink20Description: https://sigma.octopart.com:443/138820526/technical_drawing/Yageo-RC1206JR-071KL.pdf?src-supplier=Upverter; ComponentLink21URL: https://datasheet.octopart.com:443/RC1206JR-071KL-Yageo-datasheet-8359522.pdf?src-supplier=TME; ComponentLink21Description: https://datasheet.octopart.com:443/RC1206JR-071KL-Yageo-datasheet-8359522.pdf?src-supplier=TME; ComponentLink22URL: https://datasheet.octopart.com:443/RC1206JR-071KL-Yageo-datasheet-164759695.pdf?src-supplier=Future+Electronics; ComponentLink22Description: https://datasheet.octopart.com:443/RC1206JR-071KL-Yageo-datasheet-164759695.pdf?src-supplier=Future+Electronics; ComponentLink23URL: https://datasheet.octopart.com:443/RC1206JR-071KL-Yageo-datasheet-137700087.pdf?src-supplier=Future+Electronics; ComponentLink23Description: https://datasheet.octopart.com:443/RC1206JR-071KL-Yageo-datasheet-137700087.pdf?src-supplier=Future+Electronics; ComponentLink24URL: https://datasheet.octopart.com:443/RC1206JR-071KL-Yageo-datasheet-27233761.pdf?src-supplier=Future+Electronics; ComponentLink24Description: https://datasheet.octopart.com:443/RC1206JR-071KL-Yageo-datasheet-27233761.pdf?src-supplier=Future+Electronics; ComponentLink25URL: https://datasheet.octopart.com:443/RC1206JR-071KL-Yageo-datasheet-8324387.pdf?src-supplier=Future+Electronics; ComponentLink25Description: https://datasheet.octopart.com:443/RC1206JR-071KL-Yageo-datasheet-8324387.pdf?src-supplier=Future+Electronics; ComponentLink26URL: https://datasheet.octopart.com/RC1206JR-071KL-Yageo-datasheet-73766026.pdf; ComponentLink26Description: https://datasheet.octopart.com/RC1206JR-071KL-Yageo-datasheet-73766026.pdf; ComponentLink27URL: https://datasheet.octopart.com:443/RC1206JR-071KL-Yageo-datasheet-118639.pdf?src-supplier=DigiKey; ComponentLink27Description: https://datasheet.octopart.com:443/RC1206JR-071KL-Yageo-datasheet-118639.pdf?src-supplier=DigiKey; ComponentLink28URL: https://datasheet.octopart.com:443/RC1206JR-071KL-Yageo-datasheet-499455.pdf?src-supplier=element14; ComponentLink28Description: https://datasheet.octopart.com:443/RC1206JR-071KL-Yageo-datasheet-499455.pdf?src-supplier=element14; ComponentLink29URL: https://datasheet.octopart.com:443/RC1206JR-071KL-Yageo-datasheet-6387275.pdf?src-supplier=element14; ComponentLink29Description: https://datasheet.octopart.com:443/RC1206JR-071KL-Yageo-datasheet-6387275.pdf?src-supplier=element14
SWITCH_1-SWITCH_3 = PTS645SL50SMTR92LFS: SWITCH TACTILE SPST-NO 0.05A 12V; Manufacturer: C&K Components; Actuator Material: Nylon, Polyamide; Contact Current Rating: 50mA; Contact Resistance: 100mΩ; Electrical Life: 100kcycles; Illumination Type: Non-Illuminated; Insulation Resistance: 100GΩ; Number of Positions: 1; Operating Force: 1.27N; Switch Function: Off-Mom; Throw Configuration: SPST; Supplier: DigiKey; Supplier Part Number: CKN9088CT-ND; Manufacturer Part Number: PTS645SL50SMTR92LFS; RoHS: Compliant; Category: Tactile Switches; Stock: 13861; Pricing: 1=0.35, 10=0.3, 25=0.2804, 100=0.251, 250=0.23256, 500=0.21948 (USD); Color: Black; Contact Material: Bronze; Contact Plating: Silver; Current Rating: 50mA; Depth: 9mm; Height: 3.45mm; Lead Free: Lead Free; Length: 6mm; Lifecycle Status: Production; Max Current Rating: 50mA; Max Operating Temperature: 60°C; Max Voltage Rating (DC): 12V; Mechanical Life: 100kcycles; Min Operating Temperature: -20°C; Mounting Technology: Surface Mount; Orientation: Straight; Packaging: Tape and Reel; REACH SVHC: Yes; Termination: Gull Wing; Voltage Rating (DC): 12V; ComponentLink1URL: https://datasheet.octopart.com:443/PTS645SL50SMTR92LFS-C%26K-Components-datasheet-169841344.pdf?src-supplier=Newark; ComponentLink1Description: https://datasheet.octopart.com:443/PTS645SL50SMTR92LFS-C%26K-Components-datasheet-169841344.pdf?src-supplier=Newark; ComponentLink2URL: https://datasheet.octopart.com:443/PTS645SL50SMTR92LFS-C%26K-Components-datasheet-27907579.pdf?src-supplier=Newark; ComponentLink2Description: https://datasheet.octopart.com:443/PTS645SL50SMTR92LFS-C%26K-Components-datasheet-27907579.pdf?src-supplier=Newark; ComponentLink3URL: https://datasheet.octopart.com:443/PTS645SL50SMTR92LFS-C%26K-Components-datasheet-67873720.pdf?src-supplier=Master+Electronics; ComponentLink3Description: https://datasheet.octopart.com:443/PTS645SL50SMTR92LFS-C%26K-Components-datasheet-67873720.pdf?src-supplier=Master+Electronics; ComponentLink4URL: https://datasheet.octopart.com:443/PTS645SL50SMTR92LFS-C%26K-Components-datasheet-165782998.pdf?src-supplier=Farnell; ComponentLink4Description: https://datasheet.octopart.com:443/PTS645SL50SMTR92LFS-C%26K-Components-datasheet-165782998.pdf?src-supplier=Farnell; ComponentLink5URL: https://datasheet.octopart.com:443/PTS645SL50SMTR-92-LFS-C%26K-Components-datasheet-150821959.pdf?src-supplier=TME; ComponentLink5Description: https://datasheet.octopart.com:443/PTS645SL50SMTR-92-LFS-C%26K-Components-datasheet-150821959.pdf?src-supplier=TME; ComponentLink6URL: https://datasheet.octopart.com:443/PTS645SL50SMTR92LFS-C%26K-Components-datasheet-138128951.pdf?src-supplier=Future+Electronics; ComponentLink6Description: https://datasheet.octopart.com:443/PTS645SL50SMTR92LFS-C%26K-Components-datasheet-138128951.pdf?src-supplier=Future+Electronics; ComponentLink7URL: http://sigma.octopart.com:80/reach_statement/ITT-company-18.pdf?src-supplier=Compliance+Statements; ComponentLink7Description: http://sigma.octopart.com:80/reach_statement/ITT-company-18.pdf?src-supplier=Compliance+Statements; LCSC part number: C221877
U1 = AMS1117-3.3: IC REG LINEAR 3.3V 1A SOT-223; Manufacturer: UMW(Youtai Semiconductor Co., Ltd.); Supplier: DigiKey; Supplier Part Number: 4518-AMS1117-3.3CT-ND; Manufacturer Part Number: AMS1117-3.3; Category: LDO Voltage Regulators; Stock: 9165; Pricing: 1=0.68, 10=0.407, 25=0.3352, 100=0.2538, 250=0.2138, 500=0.18916, 1000=0.16853 (USD); LCSC PART NUMBER: C6186